# EAGLE schematic Gamepad_Schematic (EAGLE 9.7.0)
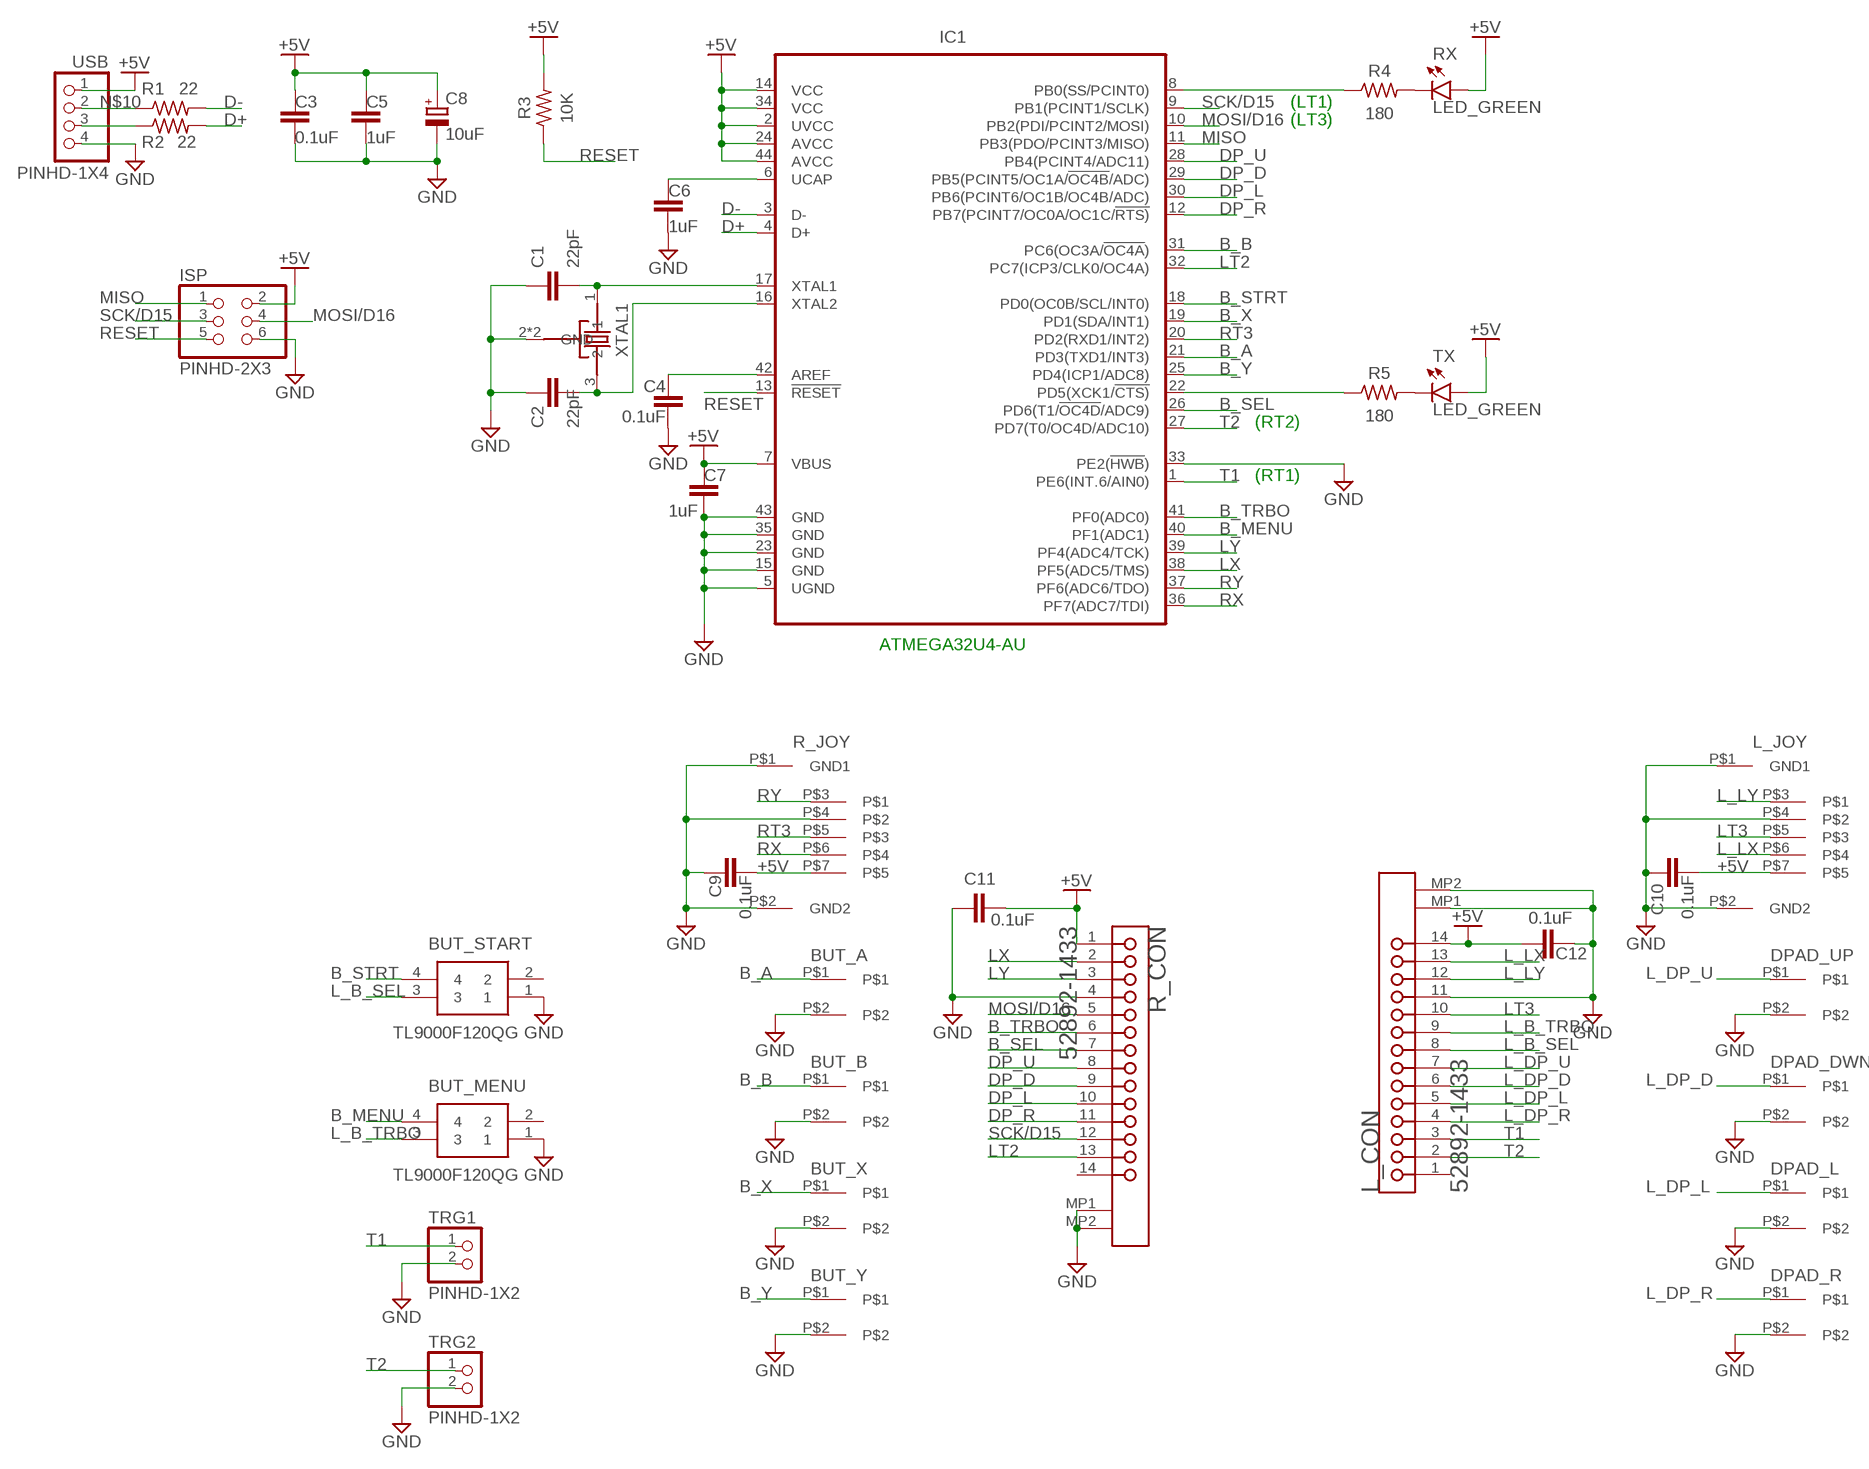
[diagram p0: schematic, sheet 1]

## Parts
BUT_A  MEMBRANEBUTTON  [MEMBRANEBUTTON]
BUT_B  MEMBRANEBUTTON  [MEMBRANEBUTTON]
BUT_MENU  TL9000F120QG  [TL9000F120QG]
BUT_START  TL9000F120QG  [TL9000F120QG]
BUT_X  MEMBRANEBUTTON  [MEMBRANEBUTTON]
BUT_Y  MEMBRANEBUTTON  [MEMBRANEBUTTON]
C1  22pF  C_CHIP-0603(1608-METRIC)  [CAPC1608X85]
C2  22pF  C_CHIP-0603(1608-METRIC)  [CAPC1608X85]
C3  0.1uF  C_CHIP-0805(2012-METRIC)  [CAPC2012X110]
C4  0.1uF  C_CHIP-0805(2012-METRIC)  [CAPC2012X110]
C5  1uF  C_CHIP-0805(2012-METRIC)  [CAPC2012X110]
C6  1uF  C_CHIP-0805(2012-METRIC)  [CAPC2012X110]
C7  1uF  C_CHIP-0805(2012-METRIC)  [CAPC2012X110]
C8  10uF  C-POL_TANTALUM-1206(3216-METRIC)  [CAPMP3216X180N]
C9  0.1uF  C_CHIP-0805(2012-METRIC)  [CAPC2012X110]
C10  0.1uF  C_CHIP-0805(2012-METRIC)  [CAPC2012X110]
C11  0.1uF  C_CHIP-0805(2012-METRIC)  [CAPC2012X110]
C12  0.1uF  C_CHIP-0805(2012-METRIC)  [CAPC2012X110]
DPAD_DWN  MEMBRANEBUTTON  [MEMBRANEBUTTON]
DPAD_L  MEMBRANEBUTTON  [MEMBRANEBUTTON]
DPAD_R  MEMBRANEBUTTON  [MEMBRANEBUTTON]
DPAD_UP  MEMBRANEBUTTON  [MEMBRANEBUTTON]
IC1  ATMEGA32U4-AU  ATMEGA16U4-AU  [QFP80P1200X1200X120-44]
ISP  PINHD-2X3  [2X03]
L_CON  MOLEX_52892-1433MOLEX_52892-1433_0_0  [MOLEX_52892-1433_0]
L_JOY  0545500571  [0545500571]
R1  22  R-US_CHIP-0805(2012-METRIC)  [RESC2012X65]
R2  22  R-US_CHIP-0805(2012-METRIC)  [RESC2012X65]
R3  10K  R-US_CHIP-0805(2012-METRIC)  [RESC2012X65]
R4  180  R-US_CHIP-0805(2012-METRIC)  [RESC2012X65]
R5  180  R-US_CHIP-0805(2012-METRIC)  [RESC2012X65]
R_CON  MOLEX_52892-1433MOLEX_52892-1433_0_0  [MOLEX_52892-1433_0]
R_JOY  0545500571  [0545500571]
RX  LED_GREEN  CHIP-FLAT-G_0603-0.55MM  [LEDC1608X55N_FLAT-G]
TRG1  PINHD-1X2  [1X02]
TRG2  PINHD-1X2  [1X02]
TX  LED_GREEN  CHIP-FLAT-G_0603-0.55MM  [LEDC1608X55N_FLAT-G]
USB  PINHD-1X4  [1X04]
XTAL1  ABM3BDIAG  [OSCCC500X320X110]

## Nets
+5V: C3.1 C5.1 C7.1 C8.1(+) C9.2 C10.2 C11.2 C12.2 IC1.2(UVCC) IC1.7(VBUS) IC1.14(VCC) IC1.24(AVCC) IC1.34(VCC) IC1.44(AVCC) ISP.2 L_CON.14 L_JOY.P$7 R3.2 R_CON.1 R_JOY.P$7 RX.A TX.A USB.1
B_A: BUT_A.P$1 IC1.21(PD3(TXD1/INT3))
B_B: BUT_B.P$1 IC1.31(PC6(OC3A/!OC4A!))
B_MENU: BUT_MENU.4 IC1.40(PF1(ADC1))
B_SEL: IC1.26(PD6(T1/!OC4D!/ADC9)) R_CON.7
B_STRT: BUT_START.4 IC1.18(PD0(OC0B/SCL/INT0))
B_TRBO: IC1.41(PF0(ADC0)) R_CON.6
B_X: BUT_X.P$1 IC1.19(PD1(SDA/INT1))
B_Y: BUT_Y.P$1 IC1.25(PD4(ICP1/ADC8))
D+: IC1.4(D+) R2.2
D-: IC1.3(D-) R1.2
DP_D: IC1.29(PB5(PCINT5/OC1A/!OC4B!/ADC)) R_CON.9
DP_L: IC1.30(PB6(PCINT6/OC1B/OC4B/ADC)) R_CON.10
DP_R: IC1.12(PB7(PCINT7/OC0A/OC1C/!RTS)) R_CON.11
DP_U: IC1.28(PB4(PCINT4/ADC11)) R_CON.8
GND: BUT_A.P$2 BUT_B.P$2 BUT_MENU.1 BUT_START.1 BUT_X.P$2 BUT_Y.P$2 C1.1 C2.1 C3.2 C4.2 C5.2 C6.2 C7.2 C8.2(-) C9.1 C10.1 C11.1 C12.1 DPAD_DWN.P$2 DPAD_L.P$2 DPAD_R.P$2 DPAD_UP.P$2 IC1.5(UGND) IC1.15(GND) IC1.23(GND) IC1.33(PE2(!HWB!)) IC1.35(GND) IC1.43(GND) ISP.6 L_CON.11 L_CON.MP1 L_CON.MP2 L_JOY.P$1(GND1) L_JOY.P$2(GND2) L_JOY.P$4 R_CON.4 R_CON.MP1 R_CON.MP2 R_JOY.P$1(GND1) R_JOY.P$2(GND2) R_JOY.P$4 TRG1.2 TRG2.2 USB.4 XTAL1.2(GND) XTAL1.4(GND)
L_B_SEL: BUT_START.3 L_CON.8
L_B_TRBO: BUT_MENU.3 L_CON.9
L_DP_D: DPAD_DWN.P$1 L_CON.6
L_DP_L: DPAD_L.P$1 L_CON.5
L_DP_R: DPAD_R.P$1 L_CON.4
L_DP_U: DPAD_UP.P$1 L_CON.7
L_LX: L_CON.13 L_JOY.P$6
L_LY: L_CON.12 L_JOY.P$3
LT2: IC1.32(PC7(ICP3/CLK0/OC4A)) R_CON.13
LT3: L_CON.10 L_JOY.P$5
LX: IC1.38(PF5(ADC5/TMS)) R_CON.2
LY: IC1.39(PF4(ADC4/TCK)) R_CON.3
MISO: IC1.11(PB3(PDO/PCINT3/MISO)) ISP.1
MOSI/D16: IC1.10(PB2(PDI/PCINT2/MOSI)) ISP.4 R_CON.5
N$1: C1.2 IC1.17(XTAL1) XTAL1.1
N$2: C6.1 IC1.6(UCAP)
N$3: R2.1 USB.3
N$4: C2.2 IC1.16(XTAL2) XTAL1.3
N$5: C4.1 IC1.42(AREF)
N$6: R4.2 RX.C
N$7: R5.2 TX.C
N$8: IC1.8(PB0(SS/PCINT0)) R4.1
N$9: IC1.22(PD5(XCK1/!CTS)) R5.1
N$10: R1.1 USB.2
RESET: IC1.13(!RESET) ISP.5 R3.1
RT3: IC1.20(PD2(RXD1/INT2)) R_JOY.P$5
RX: IC1.36(PF7(ADC7/TDI)) R_JOY.P$6
RY: IC1.37(PF6(ADC6/TDO)) R_JOY.P$3
SCK/D15: IC1.9(PB1(PCINT1/SCLK)) ISP.3 R_CON.12
T1: IC1.1(PE6(INT.6/AIN0)) L_CON.3 TRG1.1
T2: IC1.27(PD7(T0/OC4D/ADC10)) L_CON.2 TRG2.1
Unconnected: BUT_MENU.2 BUT_START.2 L_CON.1 R_CON.14

## Notes on the sheet
- (LT1)
- (LT3)
- (RT2)
- (RT1)

## Library data of the parts
BUT_A BUT_B BUT_X BUT_Y DPAD_DWN DPAD_L DPAD_R DPAD_UP = Membrane Button:MEMBRANEBUTTON
BUT_MENU BUT_START = SoftButton:TL9000F120QG: SWITCH TACTILE SPST-NO 0.05A 12V Source: Datasheet <https://componentsearchengine.com/Datasheets/1/TL9000F120QG.pdf>; DESCRIPTION: SWITCH TACTILE SPST-NO 0.05A 12V; HEIGHT: 5mm; MANUFACTURER_NAME: E-Switch; MANUFACTURER_PART_NUMBER: TL9000F120QG; MOUSER_PART_NUMBER: 612-TL9000F; MOUSER_PRICE-STOCK: https://www.mouser.com/Search/Refine.aspx?Keyword=612-TL9000F
C1-C7 C9-C12 = Capacitor:C: Capacitor - Generic; CATEGORY: Capacitor
C8 = Capacitor:C-POL: Capacitor Polarised - Generic; CATEGORY: Capacitor
IC1 = IC_Embedded:ATMEGA*U4: 8-bit Microcontroller Datasheet <https://ww1.microchip.com/downloads/en/DeviceDoc/Atmel-7766-8-bit-AVR-ATmega16U4-32U4_Datasheet.pdf> Note:For this part User needs to add thermal via in thermal pad in QFN package while designing a board.; CATEGORY: IC_Embedded; CORE: AVR; DESCRIPTION: IC MCU 8BIT 32KB FLASH 44TQFP; MANUFACTURER: Microchip Technology; MPN: ATmega32U4-AU; OPERATING_TEMP: -40°C to 85°C; PART_STATUS: Active; ROHS_COMPLIANT: COMPLIANT; SERIES: AVR® ATmega; SPEED: 16 MHz; SUB-CATEGORY: Microcontroller; TYPE: 8 bit Microcontroller
ISP = Connector:PINHD-2X3: PIN HEADER; CATEGORY: CONNECTOR; SUB-CATEGORY: PIN-HEADER
L_CON R_CON = Molex - 52892-1433:MOLEX_52892-1433: MOLX-52892-1433; CIIVA_IDS: 12958043; CIRCUITS_LOADED: 14; COMPONENT_LINK_1_DESCRIPTION: Manufacturer URL; COMPONENT_LINK_1_URL: http://www.molex.com/molex/index.jsp; COMPONENT_LINK_3_DESCRIPTION: Package Specification; COMPONENT_LINK_3_URL: http://www.molex.com/pdm_docs/sd/528921433_sd.pdf; CONTACT_POSITION: Bottom; CURRENT_MAX_PER_CONTACT: 0.5A; DATASHEET: http://www.molex.com/webdocs/datasheets/pdf/en-us/0528921433_FFC_FPC_CONNECTORS.pdf; DURABILITY_MATING_CYCLES_MAX: 20; ENTRY_ANGLE: 90degrees Angle; FOOTPRINT_VARIANT_NAME_0: Manufacturer Recommended; IMPORTED: yes; IMPORTED_FROM: vault; IMPORT_TS: 1521848386; MATED_HEIGHT: 2.00mm; MATERIAL___METAL: Phosphor Bronze; MATERIAL___PLATING_MATING: Silver, Tin-Bismuth; MATERIAL___PLATING_TERMINATION: Silver, Tin-Bismuth; MF: Molex; MOUNTING_TECHNOLOGY: Surface Mount; MPN: 52892-1433; NUMBER_OF_ROWS: 1; ORIENTATION: Right Angle; PACKAGE: 52892-1433; PACKAGE_DESCRIPTION: 14-Lead FPC Connector, Pitch 0.5 mm; PACKAGE_VERSION: Rev. A, 05/2013; PACKING: Tape and Reel; PCB_LOCATOR: No; PCB_RETENTION: Yes; PITCH___MATING_INTERFACE: 0.50mm; PITCH___TERMINATION_INTERFACE: 0.50mm; POLARIZED_TO_PCB: No; PREFIX: J; RELEASE_DATE: 1411387067; ROHS: Yes; STACKABLE: No; VAULT_GUID: 26F04467-A452-40C9-9F2E-281BCB1B200A; VAULT_REVISION: 27BAFA05-6FC6-475C-9B64-846F2B1A52BC; VOLTAGE_MAX: 50V
L_JOY R_JOY = Molex FFC:0545500571
R1-R5 = Resistor:R-US: Resistor Fixed - ANSI; CATEGORY: Resistor; SUB-CATEGORY: Fixed
RX TX = LED:CHIP-FLAT-G; CATEGORY: LED; COLOR: GREEN; DESCRIPTION: CHIP LED FLAT; SUB-CATEGORY: CHIP; TYPE: FLAT_TOP
TRG1 TRG2 = Connector:PINHD-1X2: PIN HEADER; CATEGORY: CONNECTOR; SUB-CATEGORY: PIN-HEADER
USB = Connector:PINHD-1X4: PIN HEADER; CATEGORY: CONNECTOR; SUB-CATEGORY: PIN-HEADER
XTAL1 = Crystal-SS:ABM3B: CRYSTAL 8.0000MHZ 18PF SMD 8MHz ±20ppm Crystal 18pF 200 Ohms 4-SMD, No Lead Datasheet <https://abracon.com/Resonators/abm3b.pdf>